# EAGLE design core_mcu (EAGLE 7.7.0)
DRAWING_NUMBER: V001; DRAWN: Mario Blunk / Blunk electronic; PROJECT: agile HW demo; STATUS: development

## Sheet 1 of 2: MCU
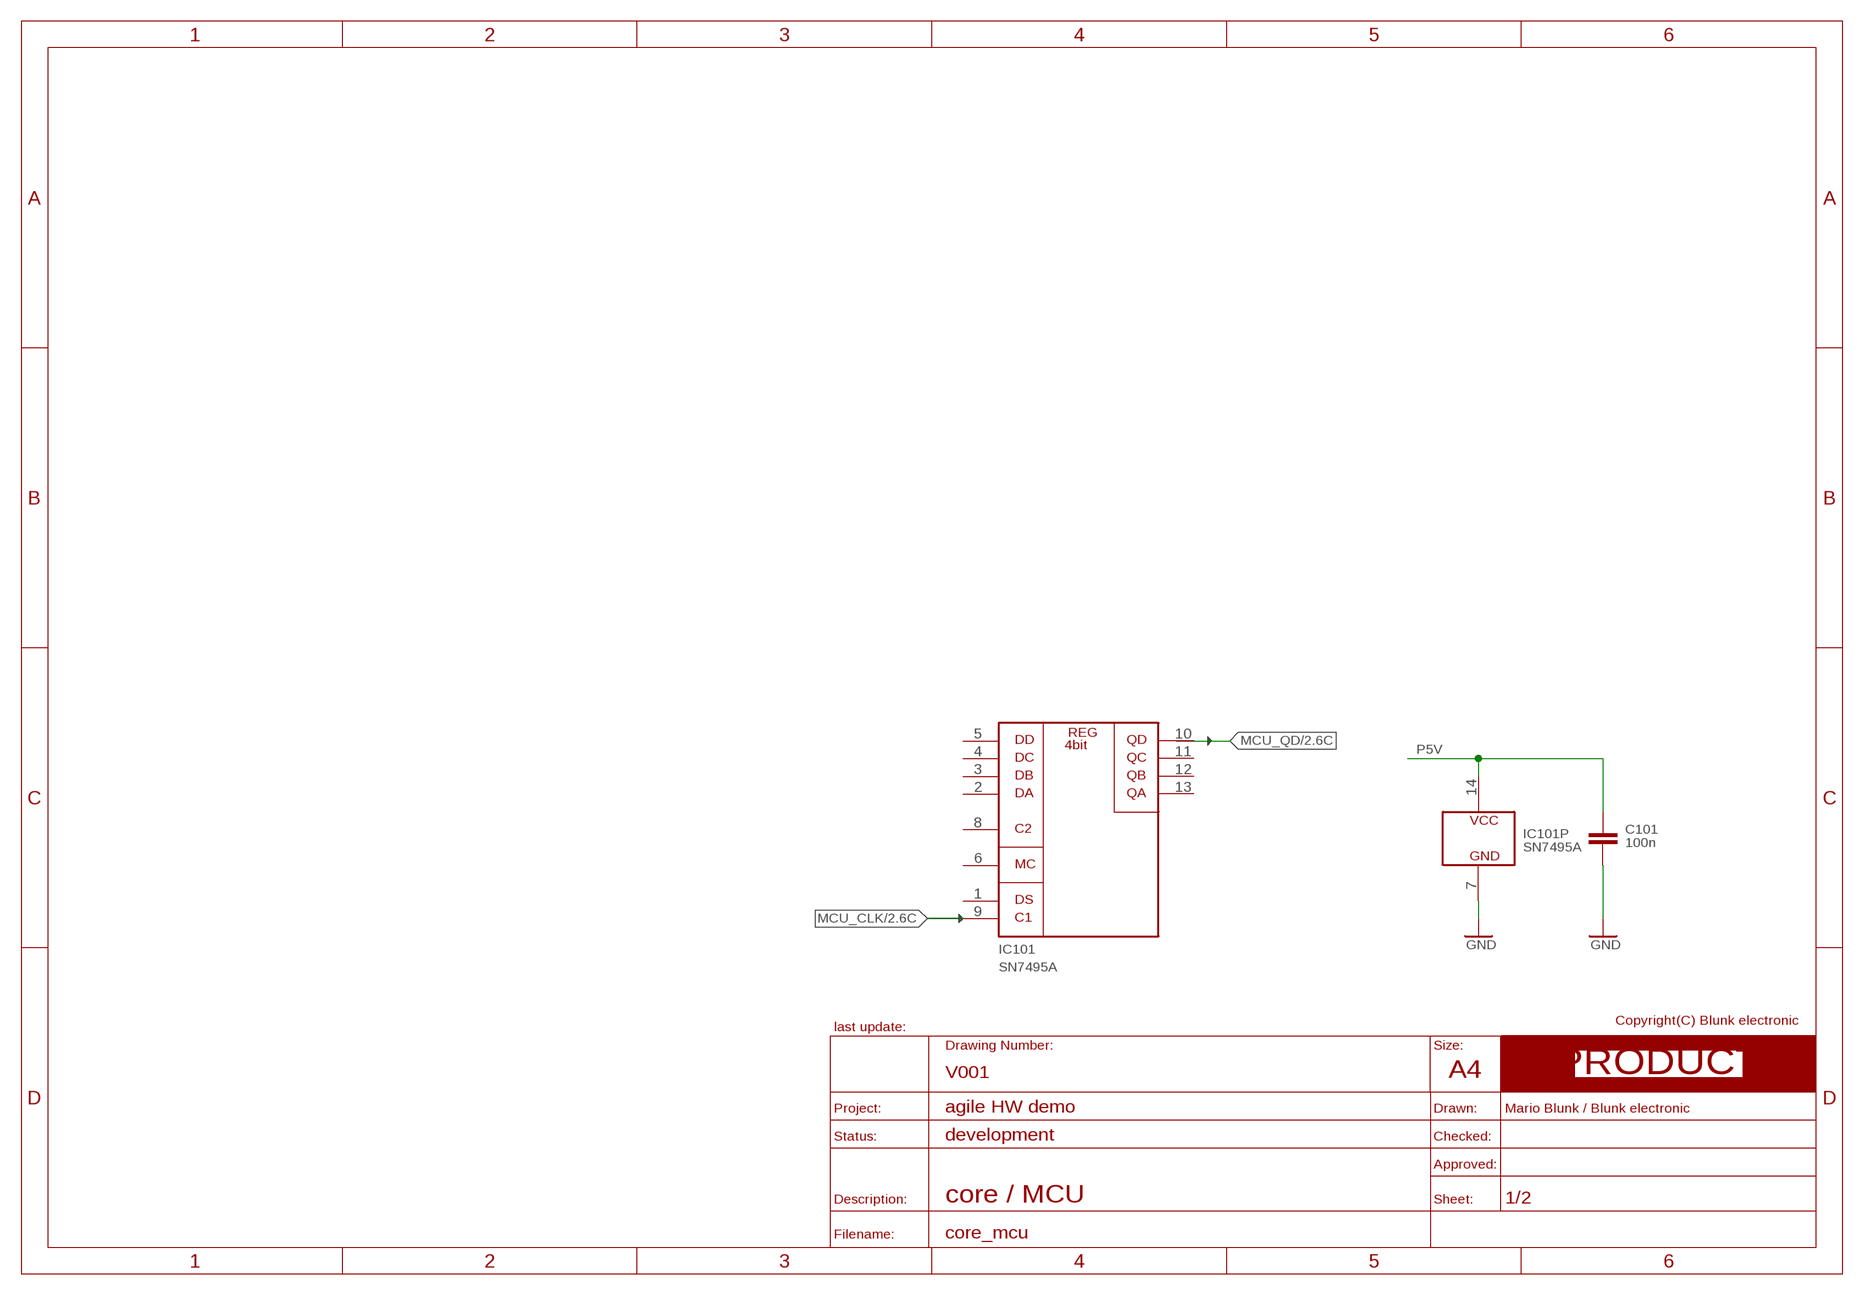
[diagram p0: schematic, sheet 1]
FRAME_PRODUCT1 (A4_LANDSCAPE_PRODUCT): BOM: NO; COMMISSIONED: 2013-08-30; DESCRIPTION: core / MCU
U$3 (ARROW_1): BOM: NO; COMMISSIONED: 2013-08-30
U$4 (ARROW_1): BOM: NO; COMMISSIONED: 2013-08-30

### Parts
C101  100n  C_S_0805  [S_0805]
IC101  SN7495A  7495A  [T_NDIP14]

### Nets
GND: C101.2 IC101.7(GND) ; also sheet 2
MCU_CLK: IC101.9(C1) ; also sheet 2
MCU_QD: IC101.10(QD) ; also sheet 2
P5V: C101.1 IC101.14(VCC) ; also sheet 2
Unconnected: IC101.1(DS) IC101.2(DA) IC101.3(DB) IC101.4(DC) IC101.5(DD) IC101.6(MC) IC101.8(C2) IC101.11(QC) IC101.12(QB) IC101.13(QA)

## Sheet 2 of 2: core debug
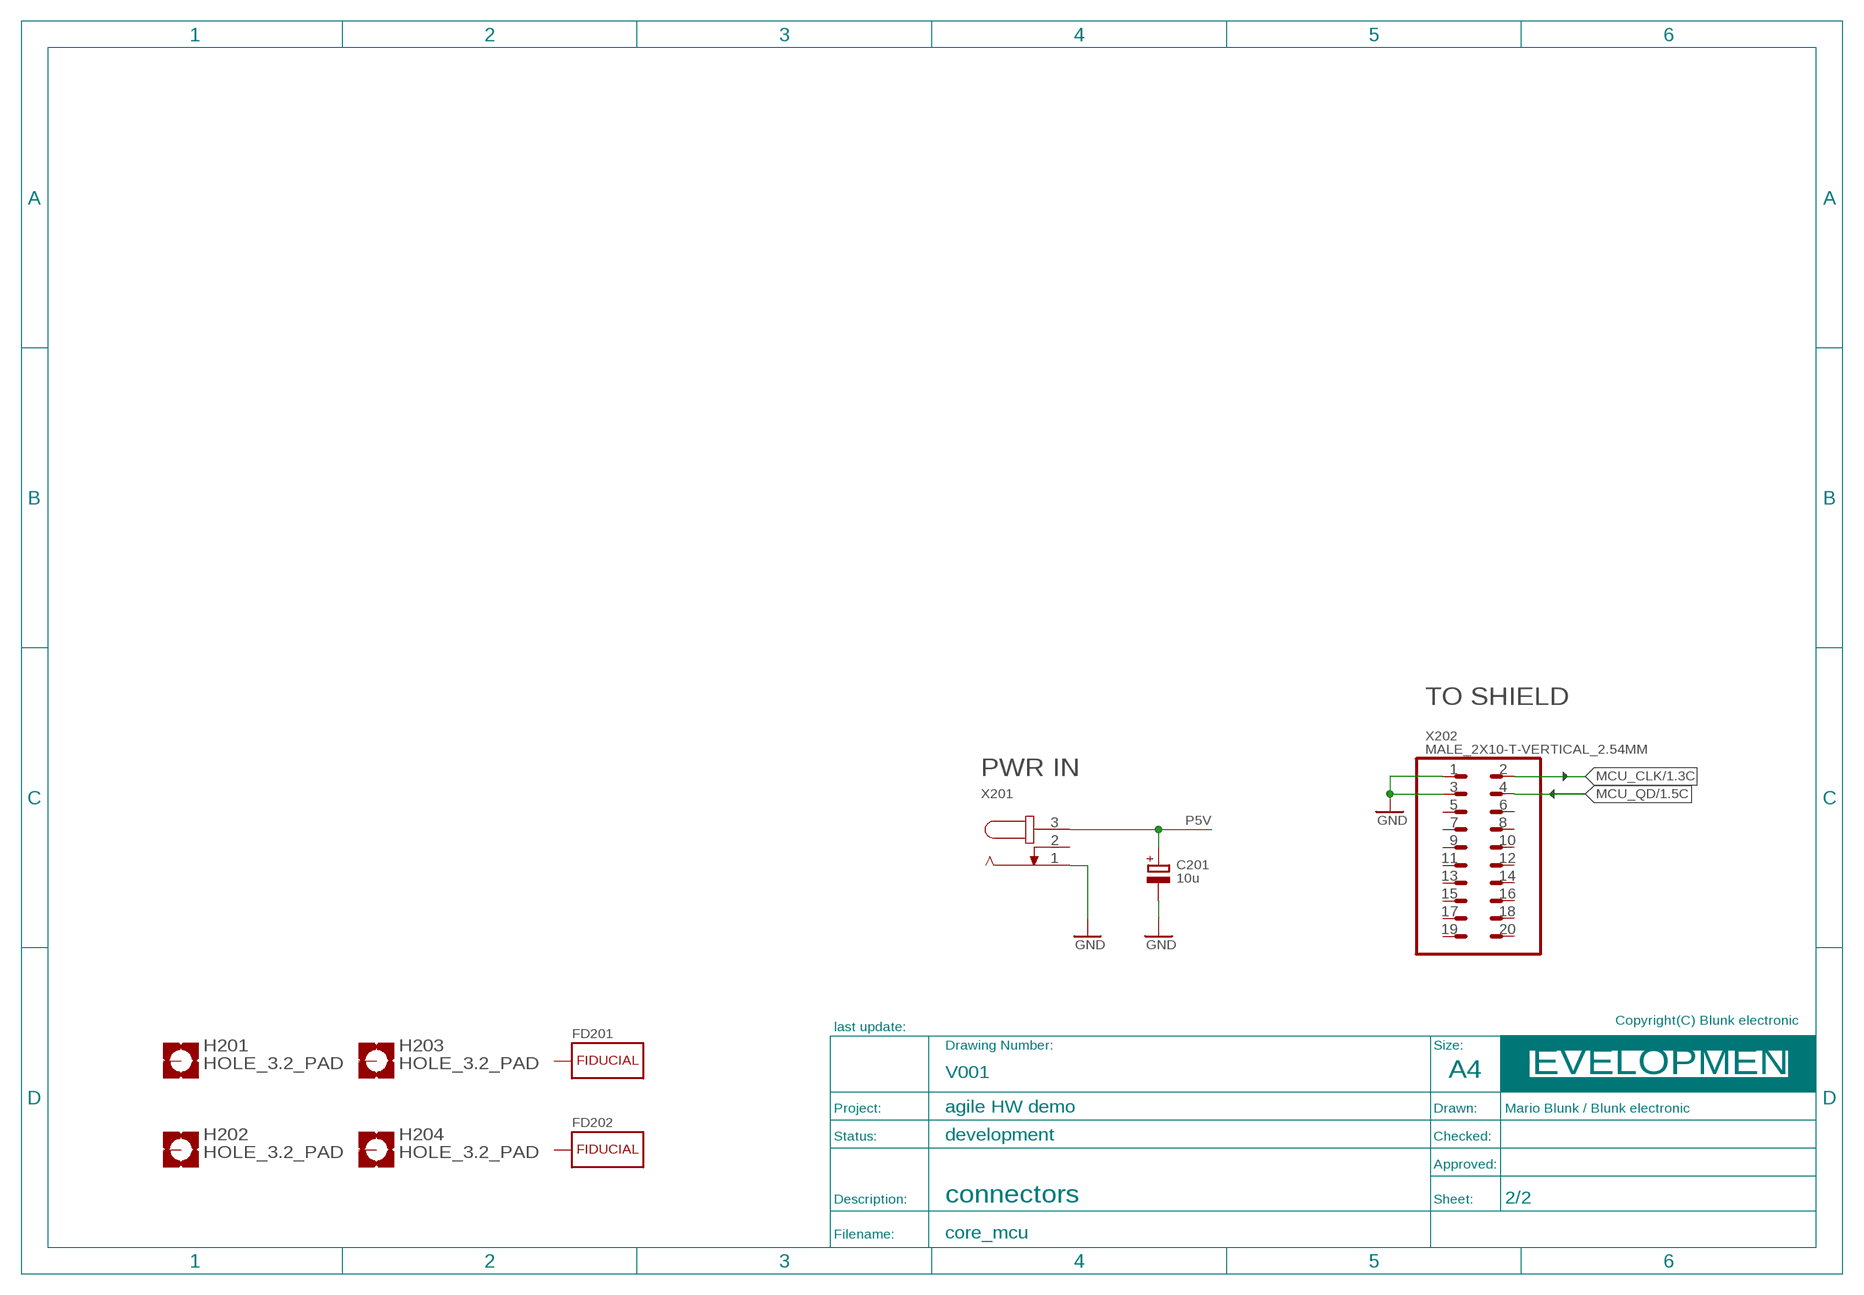
[diagram p1: schematic, sheet 2]
FRAME_DEVELOPMENT1 (A4_LANDSCAPE_DEVELOPMENT): BOM: NO; COMMISSIONED: 2013-08-30; DESCRIPTION: connectors
U$10 (ARROW_1): BOM: NO; COMMISSIONED: 2013-08-30
U$11 (ARROW_1): BOM: NO; COMMISSIONED: 2013-08-30

### Parts
C201  10u  C_POL_S_6032  [S_6032]
FD201  FIDUCIAL_CROSSHAIR  [CROSSHAIR]
FD202  FIDUCIAL_CROSSHAIR  [CROSSHAIR]
H201  HOLE_3.2_PAD  [3.2_PAD]
H202  HOLE_3.2_PAD  [3.2_PAD]
H203  HOLE_3.2_PAD  [3.2_PAD]
H204  HOLE_3.2_PAD  [3.2_PAD]
X201  POWER_JACK-T-0  [T_POWER_JACK_SPC4077]
X202  MALE_2X10-T-VERTICAL_2.54MM  [T_MALE_2X10_VERTICAL_GRID_2.54MM]

### Nets
GND: C201.- X201.1 X202.1 X202.3 ; also sheet 1
MCU_CLK: X202.2 ; also sheet 1
MCU_QD: X202.4 ; also sheet 1
P5V: C201.+ X201.3 ; also sheet 1
Unconnected: FD201.1(NC) FD202.1(NC) H201.H1(MOUNT) H202.H1(MOUNT) H203.H1(MOUNT) H204.H1(MOUNT) X201.2 X202.5 X202.6 X202.7 X202.8 X202.9 X202.10 X202.11 X202.12 X202.13 X202.14 X202.15 X202.16 X202.17 X202.18 X202.19 X202.20

## Library data of the parts
C101 = be_rcl:C: drawn: Mario Blunk / Blunk electronic; BOM: YES; COMMISSIONED: 2013-08-30; PART_CODE_BEL: C_PAC_S_0805_VAL_100n
C201 = be_rcl:C_POL: edited: Mario Blunk / Blunk electronic; BOM: YES; COMMISSIONED: 2013-08-30; PART_CODE_BEL: C_PAC_S_6032_VAL_10u_Vmax_35V
FD201 FD202 = be_marks:FIDUCIAL: drawn: Mario Blunk / Blunk electronic; BOM: NO; COMMISSIONED: 2013-12-03
H201-H204 = be_holes:HOLE: edited: Mario Blunk; BOM: NO; COMMISSIONED: 2015-01-15
IC101 = be_logic:74*95: edited: Mario Blunk / Blunk electronic; BOM: YES; COMMISSIONED: 2015-05-19; PART_CODE_BEL: IC_PAC_T_NDIP14_VAL_SN7495A
X201 = be_con_jump:POWER_JACK: DC POWER JACK Power Jack, DC, Right Angle, Through Hole, Rated 5A at 16VDC, PC Terminals Distributor: Farnell (www.Farnell.de) Drawing: 84N1161.pdf / 84N1162.pdf Manufacturer: SPC Technology (www.spctechnology.com) Type: SPC4077 / SPC 4078 edited: Mario Blunk / Blunk electronic date: 2013-03-21; BOM: YES; COMMISSIONED: 2013-08-30; FUNCTION: PWR IN; PART_CODE_BEL: X_PAC_T_POWER_JACK_SPC4077
X202 = be_con_jump:MALE_2X10: drawn: Mario Blunk / Blunk electronic; BOM: YES; COMMISSIONED: 2013-08-30; FUNCTION: TO SHIELD; PART_CODE_BEL: X_PAC_T_MALE_2X10_VERTICAL_PITCH_2mm54

## Board
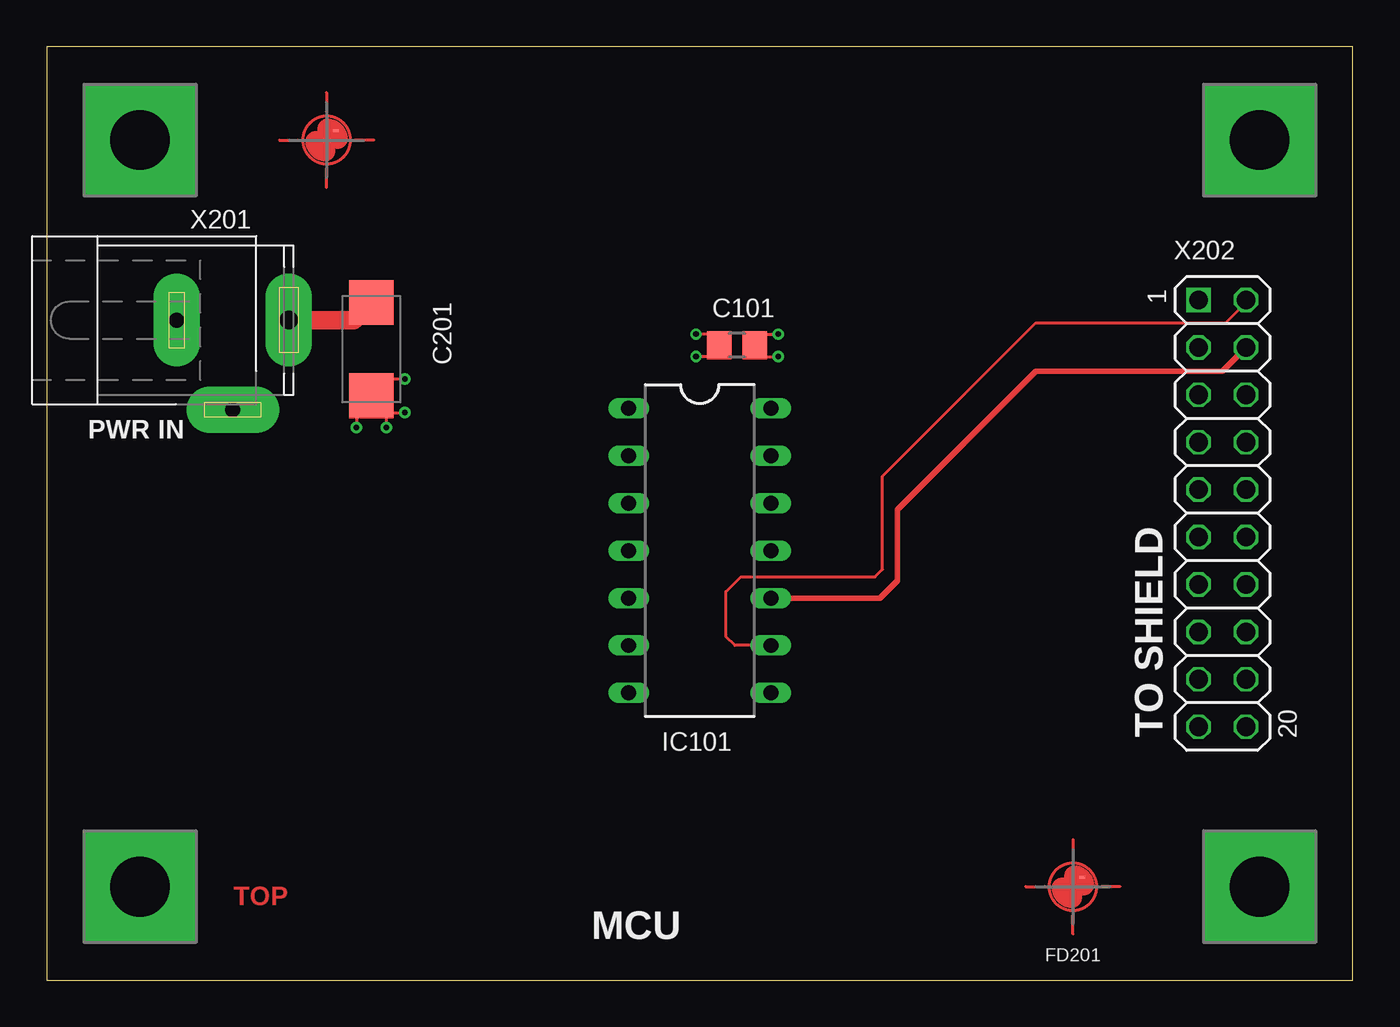
[diagram p2: board, top side]
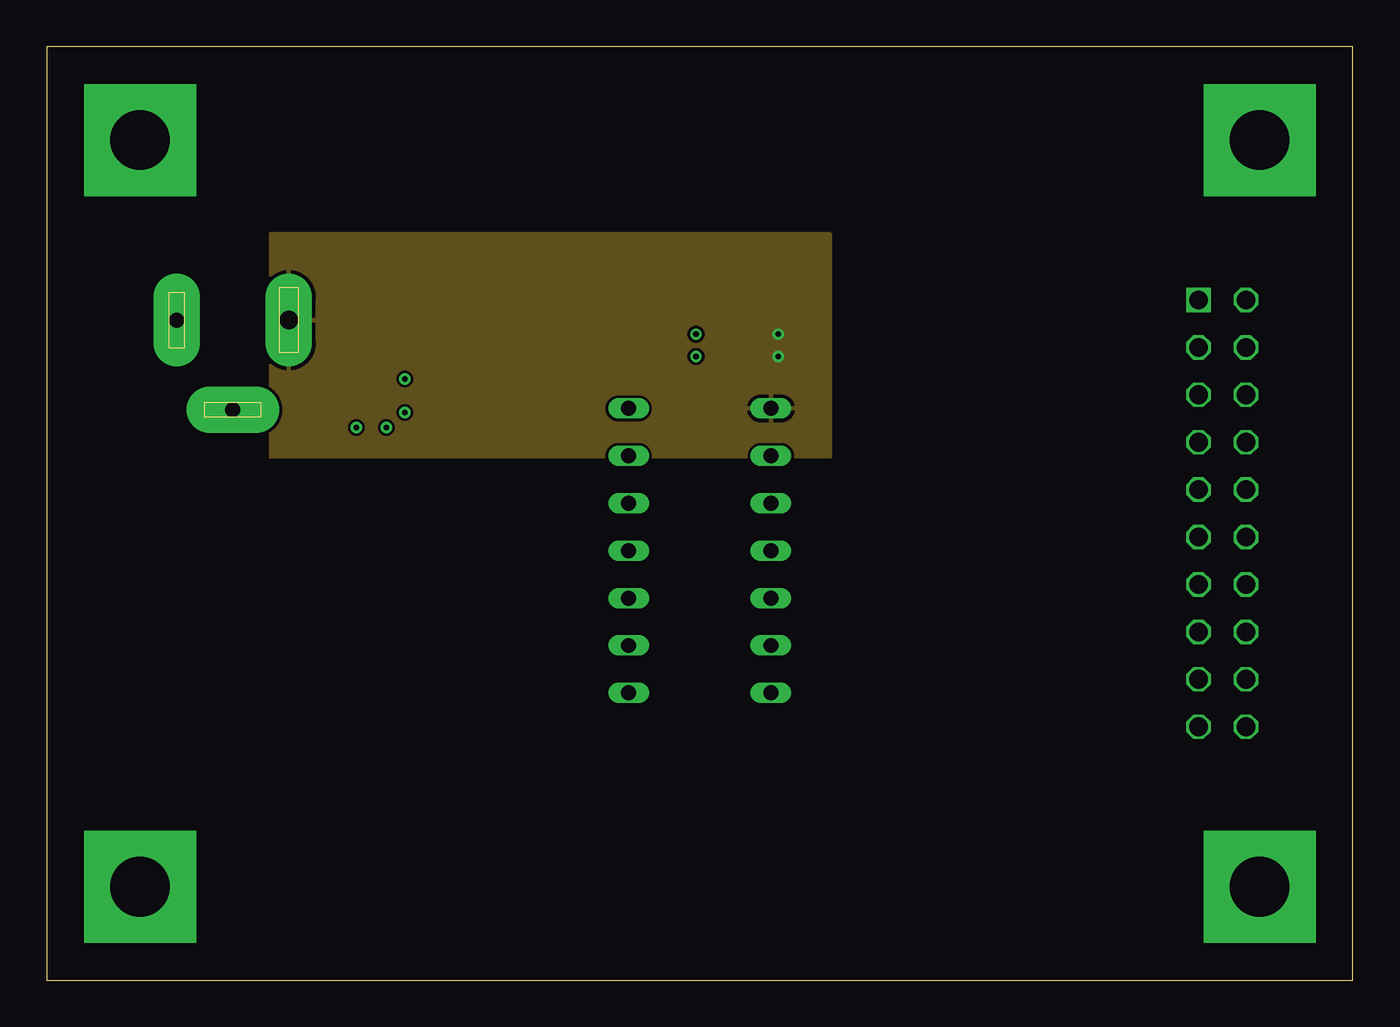
[diagram p3: board, inner layer Route2]
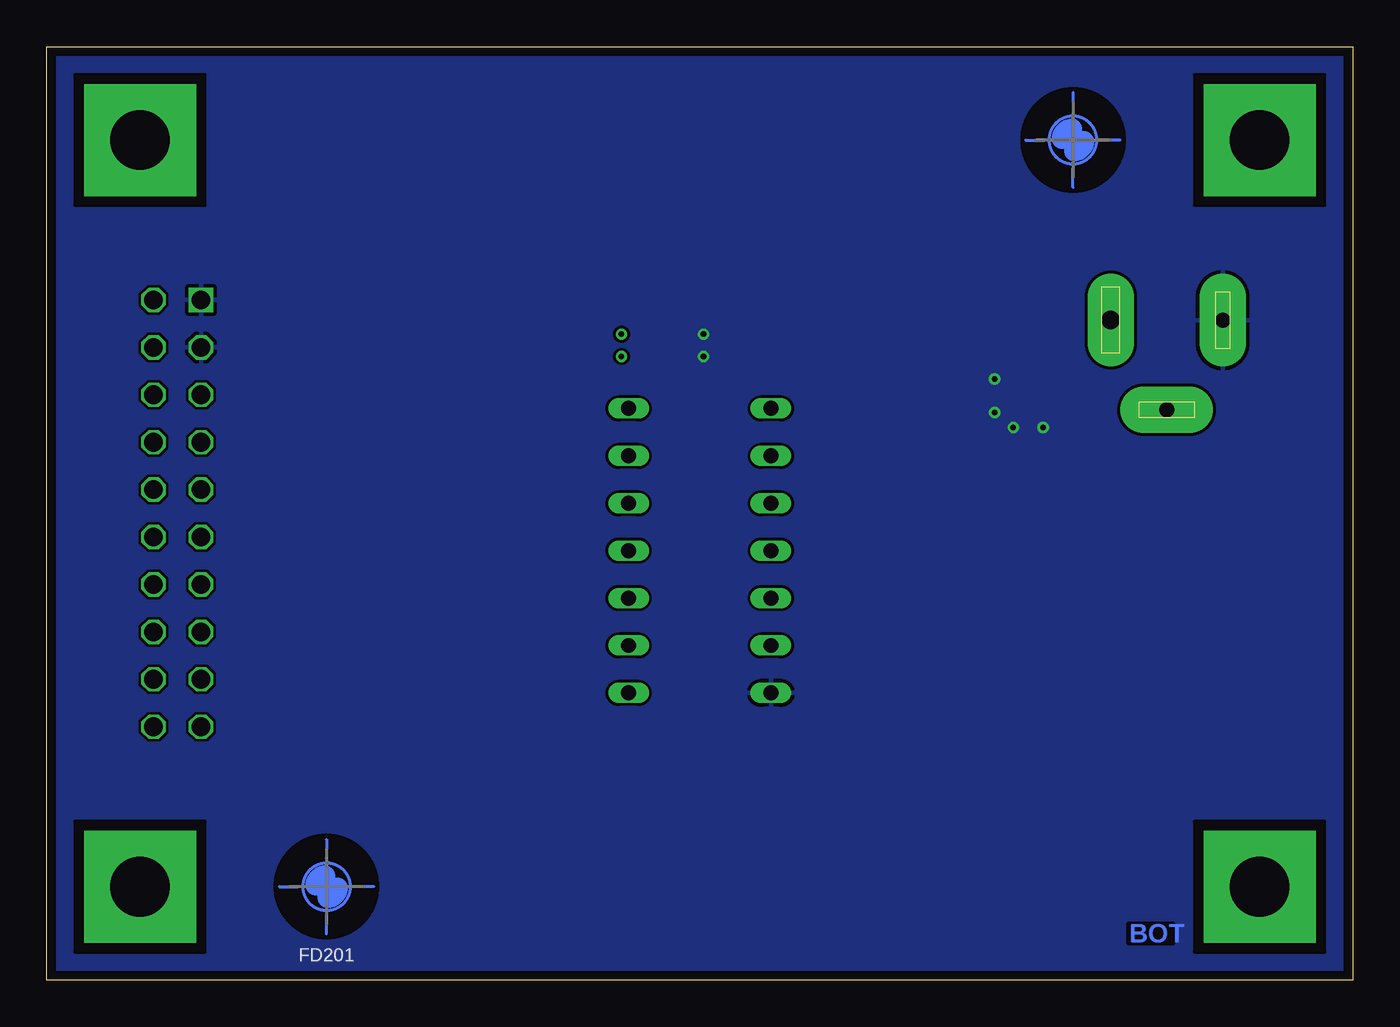
[diagram p4: board, bottom side, seen from below]

Size 70 x 50 mm. Coordinates in mm from the lower left corner, seen from the top.
Outline: 0,0 70,0 70,50 0,50 0,0
Copper layers (1+2*15+16): Top 0.018mm / dielectric 0.37mm / Route2 0.035mm / dielectric 0.65mm / Route15 0.035mm / dielectric 0.37mm / Bottom 0.018mm
Design rules "JLP_ML4_std": minimum track width 0.15mm, minimum drill 0.3mm, track to track 0.15mm, track to pad 0.15mm, pad to pad 0.15mm, via to via 0.15mm, smd to smd 0.15mm, copper to edge 0.5mm, drill to drill 0.2mm, minimum pad ring 0.15mm, minimum via ring 0.15mm, stop-mask expansion 0.075mm, vias tented up to drill 0.3mm, thermal gap 0.2mm

### Footprints (pad centres in the part's own frame; a part is rotated, then mirrored left to right if it is on the bottom)
S_0805 = smd 1.3 x 1.5: 1 -0.95,0; 2 0.95,0
S_6032 = smd 2.4 x 2.4: + -2.5,0; - 2.5,0
CROSSHAIR = smd 0.305 x 0.152: 1 0.5,0.5
3.2_PAD = drill 3.2 pad 6 square: H1 0,0
T_NDIP14 = drill 0.8 long: 1 -7.62,-3.81; 2 -5.08,-3.81; 3 -2.54,-3.81; 4 0,-3.81; 5 2.54,-3.81; 6 5.08,-3.81; 7 7.62,-3.81; 8 7.62,3.81; 9 5.08,3.81; 10 2.54,3.81; 11 0,3.81; 12 -2.54,3.81; 13 -5.08,3.81; 14 -7.62,3.81
T_POWER_JACK_SPC4077 = drill 0.8 pad 2.5 long: 1 -3,0; 2 0,-4.8 | drill 1 pad 2.5 long: 3 3,0
T_MALE_2X10_VERTICAL_GRID_2.54MM = drill 1 square: 1 -11.43,-1.27 | drill 1 octagon: 2 -11.43,1.27; 3 -8.89,-1.27; 4 -8.89,1.27; 5 -6.35,-1.27; 6 -6.35,1.27; 7 -3.81,-1.27; 8 -3.81,1.27; 9 -1.27,-1.27; 10 -1.27,1.27; 11 1.27,-1.27; 12 1.27,1.27; 13 3.81,-1.27; 14 3.81,1.27; 15 6.35,-1.27; 16 6.35,1.27; 17 8.89,-1.27; 18 8.89,1.27; 19 11.43,-1.27; 20 11.43,1.27

### Placement (x,y rotation side)
C101  37,34 180 top
C201  17.4,33.8 270 top
FD201  55,5 0 top
FD202  15,45 0 top
H201  65,45 0 top
H202  65,5 0 top
H203  5,5 0 top
H204  5,45 0 top
IC101  35,23 270 top
U$9  [A4_LANDSCAPE]  -158.4,-57 0 top  (outside the outline)
X201  9.98,35.35 0 top
X202  63,25 270 top

### Tracks (layer width: path | path; a pad name or v marks a point on that pad's centre or on a via)
GND  (via drill 0.3)
  Top 0.15: v34.8,34.6 35.45,34.6 C101.2 35.45,33.4 v34.8,33.4 | C201.- 18.3,32.2 v19.2,32.2 | C201.- 18.3,30.4 v19.2,30.4 | C201.- 16.6,30.5 v16.6,29.6 | C201.- 18.2,30.5 v18.2,29.6
  pour Bottom: 0,50 70,50 70,0 0,0
MCU_CLK
  Top 0.15: IC101.9 36.88,17.92 36.4,18.4 36.4,20.8 37.2,21.6 44.4,21.6 44.8,22 44.8,27 53,35.2 63.2,35.2 64.27,36.27 X202.2
MCU_QD
  Top 0.3: IC101.10 44.66,20.46 45.6,21.4 45.6,25.2 53,32.6 63,32.6 64.27,33.87 X202.4
P5V  (via drill 0.3)
  Top 0.15: v39.2,34.6 38.55,34.6 C101.1 38.55,33.4 v39.2,33.4
  Top 1: C201.+ 16.45,35.35 X201.3
  pour Route2: 12,40 42,40 42,28 12,28

### Text on the board
Top: TOP
Bottom: BOT
tPlace: MCU